# Altium schematic sheet Parts_Library.SchDoc
size A; SPICEModelCacheVWVXNKLP: <root> / <DocumentId>VWVXNKLP</DocumentId> / <CacheFrame Number="0"> / <Model Name="cap" Kind="MDL"> / <Text>*Default semiconductor capacitor / .MODEL CAP C()</Text> / </Model> / </CacheFrame> / </root>
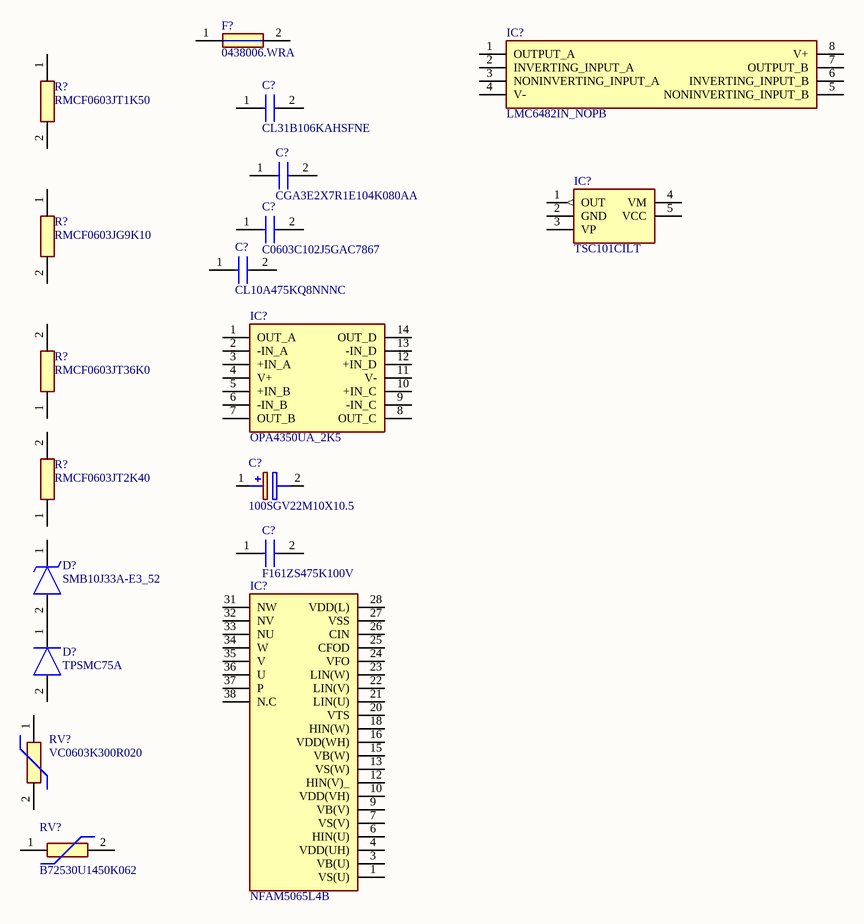
[diagram p0: Parts_Library.SchDoc]

## Parts
(Parts that share a designator on the sheet are numbered #1, #2 ... from top to bottom, then left to right.)
C?#1  CL31B106KAHSFNE  [CAPC3216X180N]
C?#2  CGA3E2X7R1E104K080AA  [CAPC1608X90N]
C?#3  C0603C102J5GAC7867  [CAPC1608X87N]
C?#4  CL10A475KQ8NNNC  [CAPC1608X90N]
C?#5  100SGV22M10X10.5  [CAPAE1030X1050N]
C?#6  F161ZS475K100V  [CAPC165150X720N]
D?#1  SMB10J33A-E3_52  [DIOM5436X244N]
D?#2  TPSMC75A  [DIOM7959X262N]
F?  0438006.WRA  [FUSC1608X61N]
IC?#1  LMC6482IN_NOPB  [DIP794W53P254L959H508Q8N]
IC?#2  TSC101CILT  [SOT95P280X145-5N]
IC?#3  OPA4350UA_2K5  [SOIC127P600X175-14N]
IC?#4  NFAM5065L4B  [NFAM5065L4B]
R?#1  RMCF0603JT1K50  [RESC1608X55N]
R?#2  RMCF0603JG9K10  [RESC1608X55N]
R?#3  RMCF0603JT36K0  [RESC1608X55N]
R?#4  RMCF0603JT2K40  [RESC1608X55N]
RV?#1  VC0603K300R020  [VARC1608X95N]
RV?#2  B72530U1450K062  [VARC3225X275N]

## Nets
NetD?#1_2: D?#1.2(A) D?#2.1(K)

Not connected (* = marked no-connect by the designer): C?#1 1 2; C?#2 1 2; C?#3 1 2; C?#4 1 2; C?#5 1(+) 2(-); C?#6 1 2; D?#1 1(K); D?#2 2(A); F? 1 2; IC?#1 1(OUTPUT_A) 2(INVERTING_INPUT_A) 3(NONINVERTING_INPUT_A) 4(V-) 5(NONINVERTING_INPUT_B) 6(INVERTING_INPUT_B) 7(OUTPUT_B) 8(V+); IC?#2 1(OUT) 2(GND) 3(VP) 4(VM) 5(VCC); IC?#3 1(OUT_A) 2(-IN_A) 3(+IN_A) 4(V+) 5(+IN_B) 6(-IN_B) 7(OUT_B) 8(OUT_C) 9(-IN_C) 10(+IN_C) 11(V-) 12(+IN_D) 13(-IN_D) 14(OUT_D); IC?#4 1(VS(U)) 3(VB(U)) 4(VDD(UH)) 6(HIN(U)) 7(VS(V)) 9(VB(V)) 10(VDD(VH)) 12(HIN(V)_) 13(VS(W)) 15(VB(W)) 16(VDD(WH)) 18(HIN(W)) 20(VTS) 21(LIN(U)) 22(LIN(V)) 23(LIN(W)) 24(VFO) 25(CFOD) 26(CIN) 27(VSS) 28(VDD(L)) 31(NW) 32(NV) 33(NU) 34(W) 35(V) 36(U) 37(P) 38(N.C); R?#1 1 2; R?#2 1 2; R?#3 1 2; R?#4 1 2; RV?#1 1 2; RV?#2 1 2

## Library data of the parts
C?#1 = CL31B106KAHSFNE: Capacitor; Manufacturer_Name: Samsung Electro-Mechanics; Datasheet Link: https://4donline.ihs.com/images/VipMasterIC/IC/SEMS/SEMS-S-A0008524868/SEMS-S-A0008524956-1.pdf?hkey=EF798316E3902B6ED9A73243A3159BB0; Height: 1.8mm; Manufacturer_Part_Number: CL31B106KAHSFNE
C?#2 = CGA3E2X7R1E104K080AA: Capacitor; Manufacturer_Name: TDK; Datasheet Link: https://product.tdk.com/system/files/dam/doc/product/capacitor/ceramic/mlcc/catalog/mlcc_automotive_general_en.pdf; Height: 0.9mm; Manufacturer_Part_Number: CGA3E2X7R1E104K080AA; Mouser Part Number: 810-CGA3E2X7R1E104K; Mouser Price/Stock: https://www.mouser.co.uk/ProductDetail/TDK/CGA3E2X7R1E104K080AA?qs=NRhsANhppD%2Fm7%2FOmmsm0vg%3D%3D; Arrow Part Number: CGA3E2X7R1E104K080AA; Arrow Price/Stock: https://www.arrow.com/en/products/cga3e2x7r1e104k080aa/tdk
C?#3 = C0603C102J5GAC7867: Capacitor; Manufacturer_Name: KEMET; Datasheet Link: https://www.kemet.com/specsheet/C0603C102J5GACTU; Height: 0.87mm; Manufacturer_Part_Number: C0603C102J5GAC7867; Mouser Part Number: N/A; Mouser Price/Stock: https://www.mouser.com/Search/Refine.aspx?Keyword=N%2FA; Arrow Part Number: C0603C102J5GAC7867; Arrow Price/Stock: https://www.arrow.com/en/products/c0603c102j5gac7867/kemet-corporation
C?#4 = CL10A475KQ8NNNC: Capacitor; Manufacturer_Name: Samsung Electro-Mechanics; Datasheet Link: https://lcsc.componentsearchengine.com/Datasheets/2/CL10A475KQ8NNNC.pdf; Height: 0.9mm; Manufacturer_Part_Number: CL10A475KQ8NNNC; Mouser Part Number: 187-CL10A475KQ8NNNC; Mouser Price/Stock: https://www.mouser.co.uk/ProductDetail/Samsung-Electro-Mechanics/CL10A475KQ8NNNC?qs=349EhDEZ59oYfMfehxxCwQ%3D%3D; Arrow Part Number: CL10A475KQ8NNNC; Arrow Price/Stock: https://www.arrow.com/en/products/cl10a475kq8nnnc/samsung-electro-mechanics?region=europe
C?#5 = 100SGV22M10X10.5: Capacitor Polarised; Manufacturer_Name: Rubycon; Datasheet Link: https://datasheet.lcsc.com/szlcsc/2004151135_Rubycon-100SGV22M10X10-5_C473179.pdf; Height: 10.5mm; Manufacturer_Part_Number: 100SGV22M10X10.5
C?#6 = F161ZS475K100V: Capacitor; Manufacturer_Name: KEMET; Datasheet Link: https://api.kemet.com/component-edge/download/datasheet/F161ZS475K100V.pdf; Height: 7.2mm; Manufacturer_Part_Number: F161ZS475K100V; Mouser Part Number: 80-F161ZS475K100V; Mouser Price/Stock: https://www.mouser.co.uk/ProductDetail/KEMET/F161ZS475K100V?qs=UljWRoG%252BxciJHBVnb319nw%3D%3D
D?#1 = SMB10J33A-E3_52: TVS Diode (Uni-directional); Manufacturer_Name: Vishay; Manufacturer_Part_Number: SMB10J33A-E3/52; Datasheet Link: https://datasheet.datasheetarchive.com/originals/distributors/Datasheets-DGA26/1848072.pdf; Height: 2.44mm
D?#2 = TPSMC75A: Diode; Manufacturer_Name: LITTELFUSE; Datasheet Link: https://www.arrow.com/en/products/tpsmc75a/littelfuse; Height: 2.62mm; Manufacturer_Part_Number: TPSMC75A; Mouser Part Number: 576-TPSMC75A; Mouser Price/Stock: https://www.mouser.com/Search/Refine.aspx?Keyword=576-TPSMC75A; Arrow Part Number: TPSMC75A; Arrow Price/Stock: https://www.arrow.com/en/products/tpsmc75a/littelfuse
F? = 0438006.WRA: Fuse; Manufacturer_Name: LITTELFUSE; Datasheet Link: https://m.littelfuse.com/~/media/electronics/datasheets/fuses/littelfuse_fuse_438a_datasheet.pdf.pdf; Height: 0.61mm; Manufacturer_Part_Number: 0438006.WRA; Mouser Part Number: 576-0438006.WRA; Mouser Price/Stock: https://www.mouser.co.uk/ProductDetail/Littelfuse/0438006WRA/?qs=wd5RIQLrsJgGoLfo6b27hA%3D%3D; Arrow Part Number: 0438006.WRA; Arrow Price/Stock: https://www.arrow.com/en/products/0438006.wra/littelfuse
IC?#1 = LMC6482IN_NOPB: Integrated Circuit; Manufacturer_Name: Texas Instruments; Manufacturer_Part_Number: LMC6482IN/NOPB; Datasheet Link: http://www.ti.com/lit/gpn/lmc6482; Height: 5.08mm; Mouser Part Number: 926-LMC6482IN/NOPB; Mouser Price/Stock: https://www.mouser.co.uk/ProductDetail/Texas-Instruments/LMC6482IN-NOPB?qs=QbsRYf82W3EByDDrj8Vijg%3D%3D; Arrow Part Number: LMC6482IN/NOPB; Arrow Price/Stock: https://www.arrow.com/en/products/lmc6482innopb/texas-instruments?region=nac
IC?#2 = TSC101CILT: Integrated Circuit; Manufacturer_Name: STMicroelectronics; Datasheet Link: http://www.st.com/st-web-ui/static/active/en/resource/technical/document/datasheet/CD00153725.pdf; Height: 1.45mm; Manufacturer_Part_Number: TSC101CILT; Mouser Part Number: 511-TSC101CILT; Mouser Price/Stock: https://www.mouser.co.uk/ProductDetail/STMicroelectronics/TSC101CILT?qs=lcekmG%2FW9sxmlDsaowrHVg%3D%3D; Arrow Part Number: TSC101CILT; Arrow Price/Stock: https://www.arrow.com/en/products/tsc101cilt/stmicroelectronics
IC?#3 = OPA4350UA_2K5: Integrated Circuit; Manufacturer_Name: Texas Instruments; Manufacturer_Part_Number: OPA4350UA/2K5; Datasheet Link: http://www.ti.com/lit/gpn/OPA4350; Height: 1.75mm; Mouser Part Number: 595-OPA4350UA/2K5; Mouser Price/Stock: https://www.mouser.co.uk/ProductDetail/Texas-Instruments/OPA4350UA-2K5?qs=wgAEGBTxy7nGaEbuwHr6bA%3D%3D; Arrow Part Number: OPA4350UA/2K5; Arrow Price/Stock: https://www.arrow.com/en/products/opa4350ua2k5/texas-instruments?region=nac
IC?#4 = NFAM5065L4B: Integrated Circuit; Manufacturer_Name: ON Semiconductor; Datasheet Link: https://www.onsemi.com/pub/Collateral/NFAM5065L4B-D.PDF; Height: 5.7mm; Manufacturer_Part_Number: NFAM5065L4B; Mouser Part Number: 863-NFAM5065L4B; Mouser Price/Stock: https://www.mouser.co.uk/ProductDetail/ON-Semiconductor/NFAM5065L4B?qs=XeJtXLiO41S6EjucZAfhuA%3D%3D
R?#1 = RMCF0603JT1K50: Resistor; Manufacturer_Name: Stackpole Electronics Inc.; Datasheet Link: https://www.seielect.com/catalog/sei-rmcf_rmcp.pdf; Height: 0.55mm; Manufacturer_Part_Number: RMCF0603JT1K50
R?#2 = RMCF0603JG9K10: Resistor; Manufacturer_Name: Stackpole Electronics Inc.; Datasheet Link: https://www.seielect.com/Catalog/SEI-RMCF_RMCP.pdf; Height: 0.55mm; Manufacturer_Part_Number: RMCF0603JG9K10
R?#3 = RMCF0603JT36K0: Resistor; Manufacturer_Name: Stackpole Electronics Inc.; Datasheet Link: https://www.seielect.com/Catalog/SEI-RMCF_RMCP.pdf; Height: 0.55mm; Manufacturer_Part_Number: RMCF0603JT36K0
R?#4 = RMCF0603JT2K40: Resistor; Manufacturer_Name: Stackpole Electronics Inc.; Datasheet Link: https://www.seielect.com/catalog/sei-rmcf_rmcp.pdf; Height: 0.55mm; Manufacturer_Part_Number: RMCF0603JT2K40; Arrow Part Number: RMCF0603JT2K40; Arrow Price/Stock: https://www.arrow.com/en/products/rmcf0603jt2k40/stackpole-electronics
RV?#1 = VC0603K300R020: Varistor; Manufacturer_Name: KEMET; Datasheet Link: https://componentsearchengine.com/Datasheets/2/VC0603K300R020.pdf; Height: 0.95mm; Manufacturer_Part_Number: VC0603K300R020; Mouser Part Number: 80-VC0603K300R020; Mouser Price/Stock: https://www.mouser.co.uk/ProductDetail/KEMET/VC0603K300R020/?qs=jj7GbYRQuOYdYgrwFUH0tQ%3D%3D
RV?#2 = B72530U1450K062: Varistor; Manufacturer_Name: TDK; Datasheet Link: https://product.tdk.com/system/files/dam/doc/product/protection/voltage/varistor_ctvs/data_sheet/75/db/ctvs_14/ct1210k45e2g.pdf; Height: 2.75mm; Manufacturer_Part_Number: B72530U1450K062; Mouser Part Number: 871-B72530U1450K062; Mouser Price/Stock: https://www.mouser.co.uk/ProductDetail/EPCOS-TDK/B72530U1450K062?qs=vHuUswq2%252BszHBcenjfcbeQ%3D%3D